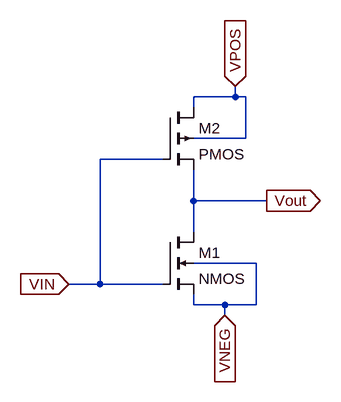
[diagram p0: schematic CMOS_Inverter.asc]
CMOS_Inverter.asc, the LTspice schematic file:
Version 4
SHEET 1 880 680
WIRE 256 -112 256 -128
WIRE 256 -112 192 -112
WIRE 272 -112 256 -112
WIRE 192 -96 192 -112
WIRE 272 -48 272 -112
WIRE 272 -48 192 -48
WIRE 144 -16 48 -16
WIRE 192 48 192 0
WIRE 304 48 192 48
WIRE 192 96 192 48
WIRE 288 144 192 144
WIRE 48 176 48 -16
WIRE 48 176 0 176
WIRE 144 176 48 176
WIRE 192 208 192 192
WIRE 240 208 192 208
WIRE 288 208 288 144
WIRE 288 208 240 208
WIRE 240 224 240 208
FLAG 304 48 Vout
IOPIN 304 48 Out
FLAG 256 -128 VPOS
IOPIN 256 -128 In
FLAG 240 224 VNEG
IOPIN 240 224 In
FLAG 0 176 VIN
IOPIN 0 176 In
SYMBOL nmos4 144 96 R0
SYMATTR InstName M1
SYMATTR Value2 l=0.6u w=1.8u
SYMBOL pmos4 144 -96 R0
SYMATTR InstName M2
SYMATTR Value2 l=0.6u w=1.8u

The netlist it stands for:
* CMOS_Inverter.asc
M1 Vout VIN VNEG VNEG NMOS l=0.6u w=1.8u
M2 VPOS VIN Vout VPOS PMOS l=0.6u w=1.8u
.model NMOS NMOS
.model PMOS PMOS
.lib standard.mos
.backanno
.end